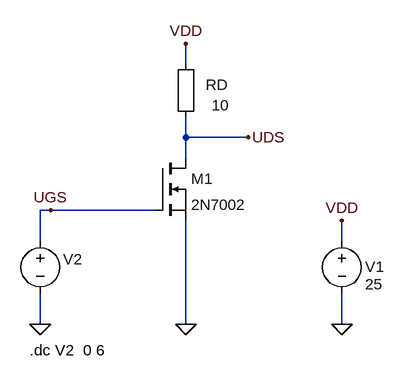
[diagram p0: schematic gfs_vs_ID.asc]
gfs_vs_ID.asc, the LTspice schematic file:
Version 4
SHEET 1 1292 680
WIRE -720 -272 -720 -304
WIRE -720 -160 -720 -192
WIRE -624 -160 -720 -160
WIRE -720 -128 -720 -160
WIRE -928 -48 -944 -48
WIRE -768 -48 -928 -48
WIRE -944 0 -944 -48
WIRE -480 0 -480 -32
WIRE -944 128 -944 80
WIRE -720 128 -720 -32
WIRE -480 128 -480 80
FLAG -480 128 0
FLAG -944 128 0
FLAG -720 128 0
FLAG -480 -32 VDD
FLAG -720 -304 VDD
FLAG -624 -160 UDS
FLAG -928 -48 UGS
SYMBOL voltage -480 -16 R0
WINDOW 123 0 0 Left 2
WINDOW 39 37 60 Left 2
WINDOW 0 36 55 Left 2
WINDOW 3 36 82 Left 2
SYMATTR InstName V1
SYMATTR Value 25
SYMBOL voltage -944 -16 R0
WINDOW 123 0 0 Left 2
WINDOW 39 40 53 Left 2
WINDOW 3 -97 181 Left 2
WINDOW 0 35 44 Left 2
SYMATTR Value ""
SYMATTR InstName V2
SYMBOL Misc\\EuropeanResistor -704 -176 R180
WINDOW 0 -49 65 Left 2
WINDOW 3 -51 33 Left 2
SYMATTR InstName RD
SYMATTR Value 10
SYMBOL nmos -768 -128 R0
SYMATTR InstName M1
SYMATTR Value 2N7002
TEXT -960 168 Left 2 !.dc V2  0 6

The netlist it stands for:
* gfs_vs_ID.asc
V1 VDD 0 25
V2 UGS 0
RD UDS VDD 10
M1 UDS UGS 0 0 2N7002
.model NMOS NMOS
.model PMOS PMOS
.lib standard.mos
.dc V2  0 6
.backanno
.end